# EAGLE design wifi-shield (EAGLE 6.5.0)
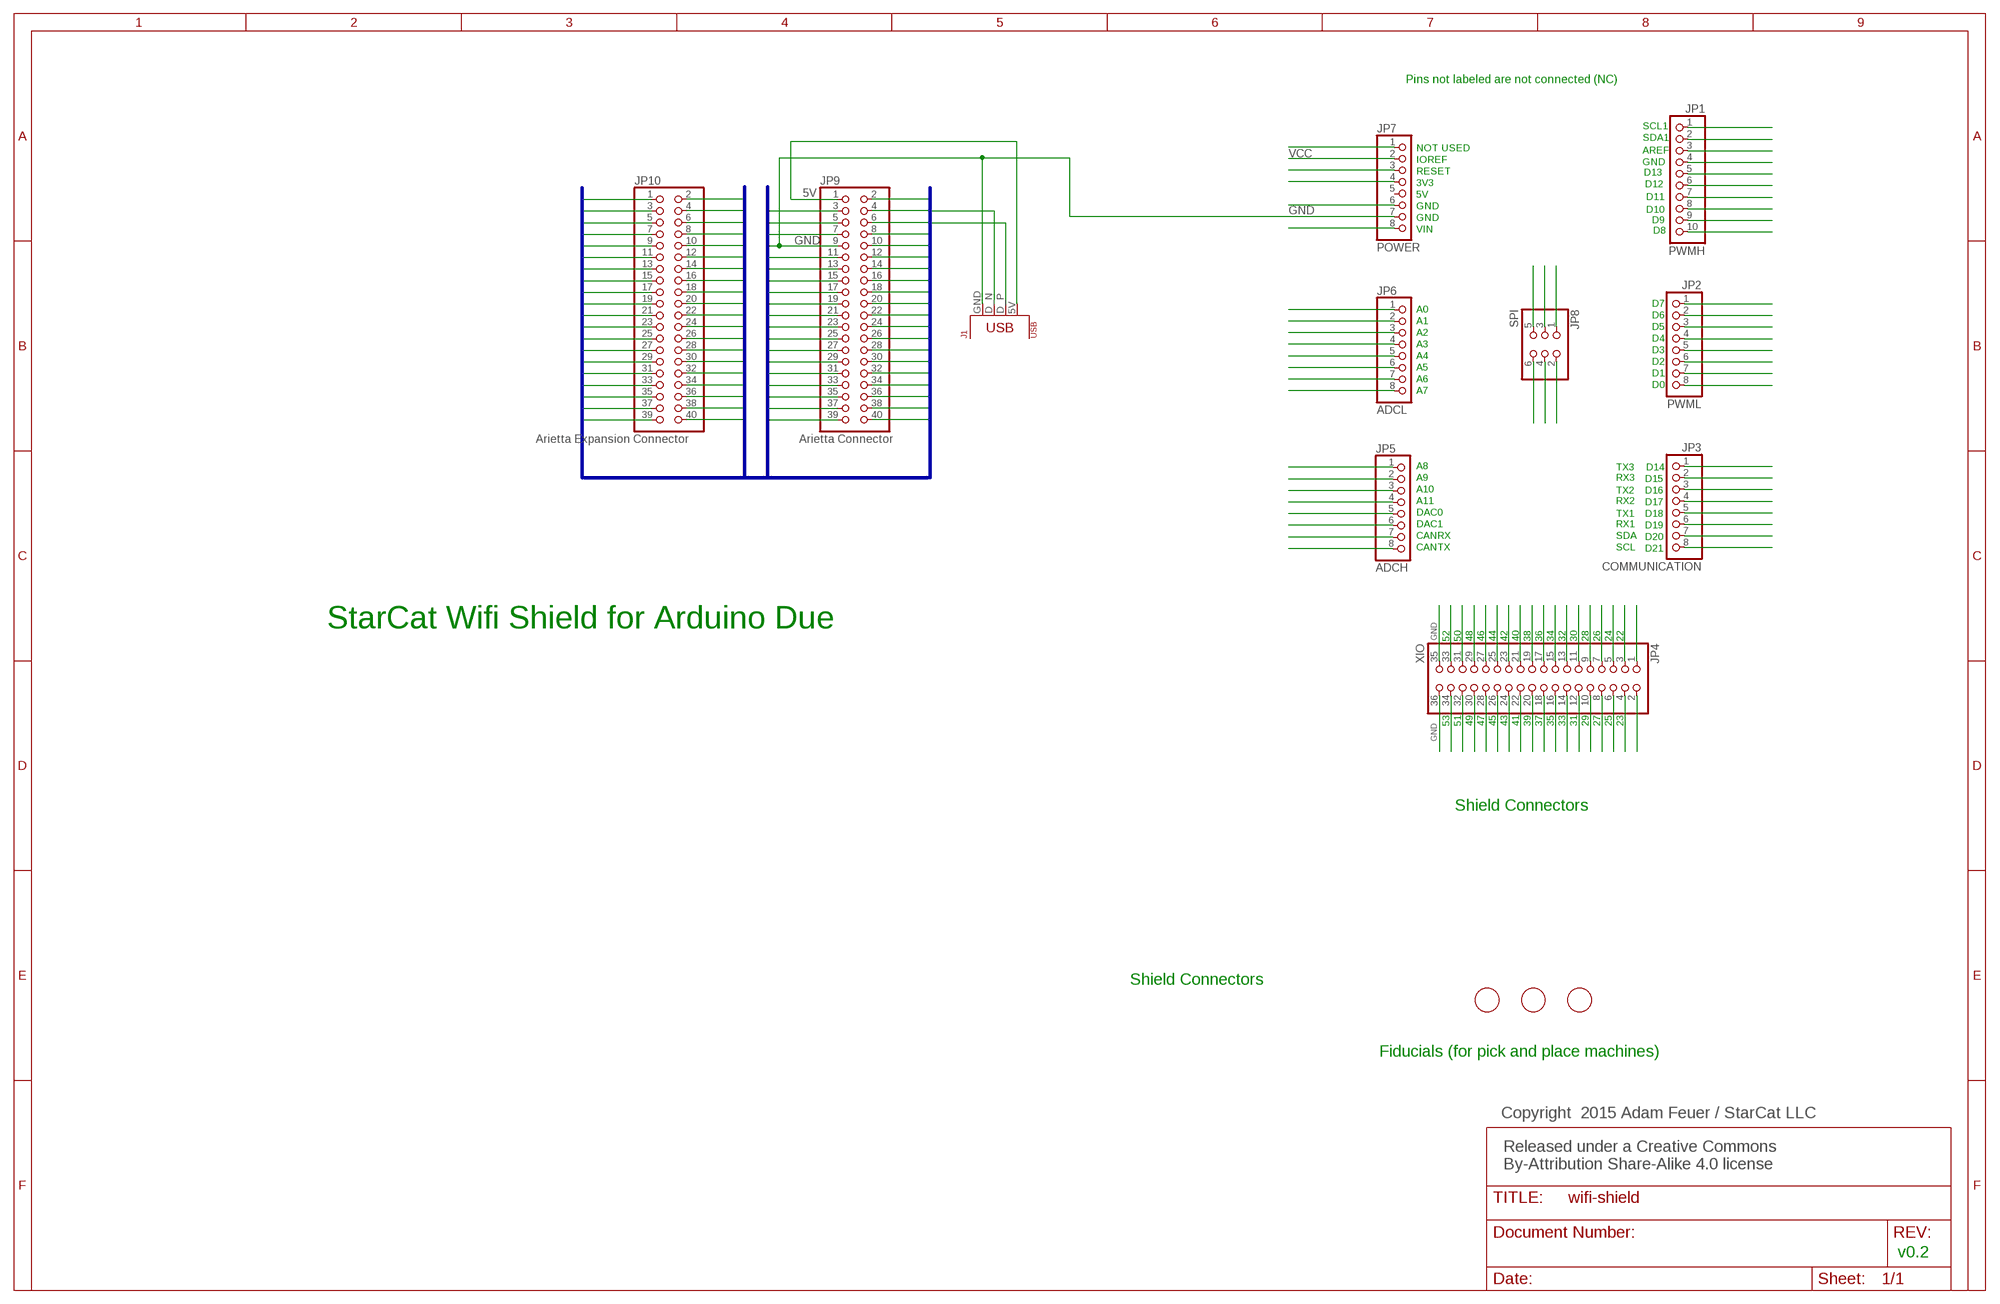
[diagram p0: schematic, sheet 1]

## Parts
J1  USB  USB-A-FEMALEUSB-A-RIGHT-ANGLE  [USB-A-FEMALE-RIGHT-ANGLE]
JP1  PWMH  PINHD-1X10  [1X10]
JP2  PWML  PINHD-1X8  [1X08]
JP3  COMMUNICATION  PINHD-1X8  [1X08]
JP4  XIO  PINHD-2X18  [2X18]
JP5  ADCH  PINHD-1X8  [1X08]
JP6  ADCL  PINHD-1X8  [1X08]
JP7  POWER  PINHD-1X8  [1X08]
JP8  SPI  PINHD-2X3  [2X03]
JP9  Arietta Connector  PINHD-2X20  [2X20]
JP10  Arietta Expansion Connector  PINHD-2X20  [2X20]
U$2  FIDUCIAL  [FIDUCIAL_1MM]
U$5  FIDUCIAL  [FIDUCIAL_1MM]
U$6  FIDUCIAL  [FIDUCIAL_1MM]

## Nets
5V [5V]: J1.5V JP9.1 JP10.1
D2 [DATA]: JP9.2 JP10.2
D3 [DATA]: JP9.3 JP10.3
D5: JP9.5 JP10.5
D7 [DATA]: JP9.7 JP10.7
D8 [DATA]: JP9.8 JP10.8
D10 [DATA]: JP9.10 JP10.10
D11 [DATA]: JP9.11 JP10.11
D12 [DATA]: JP9.12 JP10.12
D13 [DATA]: JP9.13 JP10.13
D14 [DATA]: JP9.14 JP10.14
D15 [DATA]: JP9.15 JP10.15
D16 [DATA]: JP9.16 JP10.16
D17 [DATA]: JP9.17 JP10.17
D18 [DATA]: JP9.18 JP10.18
D19 [DATA]: JP9.19 JP10.19
D20 [DATA]: JP9.20 JP10.20
D21 [DATA]: JP9.21 JP10.21
D22 [DATA]: JP9.22 JP10.22
D23 [DATA]: JP9.23 JP10.23
D24 [DATA]: JP9.24 JP10.24
D25 [DATA]: JP9.25 JP10.25
D26 [DATA]: JP9.26 JP10.26
D27 [DATA]: JP9.27 JP10.27
D28 [DATA]: JP9.28 JP10.28
D29 [DATA]: JP9.29 JP10.29
D30 [DATA]: JP9.30 JP10.30
D31 [DATA]: JP9.31 JP10.31
D32 [DATA]: JP9.32 JP10.32
D33 [DATA]: JP9.33 JP10.33
D34 [DATA]: JP9.34 JP10.34
D35 [DATA]: JP9.35 JP10.35
D36 [DATA]: JP9.36 JP10.36
D37 [DATA]: JP9.37 JP10.37
D38 [DATA]: JP9.38 JP10.38
D39 [DATA]: JP9.39 JP10.39
D40 [DATA]: JP9.40 JP10.40
D43: JP4.24
D45: JP4.26
D_N: J1.D_N JP9.4 JP10.4
D_P: J1.D_P JP9.6 JP10.6
GND [GND]: J1.GND JP4.35 JP4.36 JP7.7 JP9.9 JP10.9
GND1 [GND]: JP8.6
N$1: JP1.9
N$2: JP5.1
N$3: JP7.1
N$4: JP3.7
N$5: JP2.7
N$7: JP1.3
N$8: JP1.4
N$9: JP1.5
N$10: JP1.6
N$11: JP1.7
N$12: JP1.10
N$13: JP2.1
N$14: JP2.2
N$15: JP2.3
N$16: JP2.5
N$17: JP2.6
N$18: JP2.8
N$19: JP3.1
N$22: JP3.2
N$25: JP3.5
N$26: JP3.6
N$32: JP3.8
N$37: JP5.8
N$38: JP4.19
N$39: JP4.20
N$40: JP4.21
N$41: JP4.22
N$42: JP4.23
N$43: JP5.7
N$44: JP5.6
N$44A: JP4.25
N$55: JP5.5
N$56: JP5.4
N$57: JP5.3
N$58: JP5.2
N$65: JP6.4
N$66: JP6.3
N$68: JP6.2
N$69: JP7.8
N$71: JP7.6
N$72: JP7.3
N$73: JP4.34
N$74: JP4.32
N$89: JP4.18
N$91: JP4.16
N$92: JP4.10
N$93: JP4.3
N$94: JP4.9
N$96: JP4.15
N$97: JP4.17
N$109: JP4.31
N$110: JP6.6
N$112: JP6.7
N$115: JP4.1
N$116: JP4.2
N$569: JP6.8
N$571: JP7.4
N$572: JP6.1
N$573: JP6.5
N$574: JP1.1
N$575: JP1.2
N$576: JP1.8
N$577: JP2.4
N$578: JP3.3
N$579: JP3.4
N$580: JP4.5
N$581: JP4.7
N$582: JP4.11
N$583: JP4.13
N$584: JP4.27
N$585: JP4.29
N$586: JP4.33
N$587: JP4.4
N$588: JP4.6
N$589: JP4.8
N$590: JP4.12
N$591: JP4.14
N$592: JP4.30
N$601: JP4.28
RESET: JP8.5
SPI0_MISO: JP8.1
SPI0_MOSI: JP8.4
SPI0_SCK: JP8.3
VCC: JP7.2
VCC_5V: JP8.2
Unconnected: JP7.5

## Buses
D[1..40],D_N,D_P,5V,GND

## Notes on the sheet
- Pins not labeled are not connected (NC)
- SCL1
- SDA1
- NOT USED | AREF
- IOREF | GND
- RESET | D13
- 3V3 | D12
- 5V | D11
- GND
- D10
- GND | D9
- VIN | D8
- D7
- A0
- D6
- A1
- D5
- A2
- D4
- A3
- D3
- A4
- D2
- A5
- D1
- A6
- D0
- A7
- A8 | TX3 | D14
- A9 | RX3 | D15
- A10 | TX2 | D16
- A11 | RX2 | D17
- DAC0 | TX1 | D18
- DAC1 | RX1 | D19
- CANRX | SDA | D20
- CANTX | SCL | D21
- StarCat Wifi Shield for Arduino Due
- 52 | 50 | 48 | 46 | 44 | 42 | 40 | 38 | 36 | 34 | 32 | 30 | 28 | 26 | 24 | 22
- 53 | 51 | 49 | 47 | 45 | 43 | 41 | 39 | 37 | 35 | 33 | 31 | 29 | 27 | 25 | 23
- Shield Connectors
- Shield Connectors
- Fiducials (for pick and place machines)
- Copyright  2015 Adam Feuer / StarCat LLC
- Released under a Creative Commons 
  By-Attribution Share-Alike 4.0 license
- v0.2

## Library data of the parts
J1 = te-conn-usb:USB-A-FEMALE: USB A Female connector - TE Connectivity PN 292303-1
JP1 = SmartPrj:PINHD-1X10: PIN HEADER
JP2 JP3 JP5-JP7 = SmartPrj:PINHD-1X8: PIN HEADER
JP4 = SmartPrj:PINHD-2X18: PIN HEADER
JP8 = SmartPrj:PINHD-2X3: PIN HEADER
JP9 JP10 = adafruit:PINHD-2X20: PIN HEADER
U$2 U$5 U$6 = adafruit:FIDUCIAL: For use by pick and place machines to calibrate the vision/machine, 1mm By microbuilder.eu

## Net classes
0 USB_A: width 0.203 mm, drill 0.203 mm, clearance 0.203 mm
1 5V: width 0.203 mm, drill 0.203 mm, clearance 0.203 mm
2 GND: width 0.203 mm, drill 0.203 mm, clearance 0.203 mm
3 DATA: width 0.203 mm, drill 0.203 mm, clearance 0.203 mm

## Board
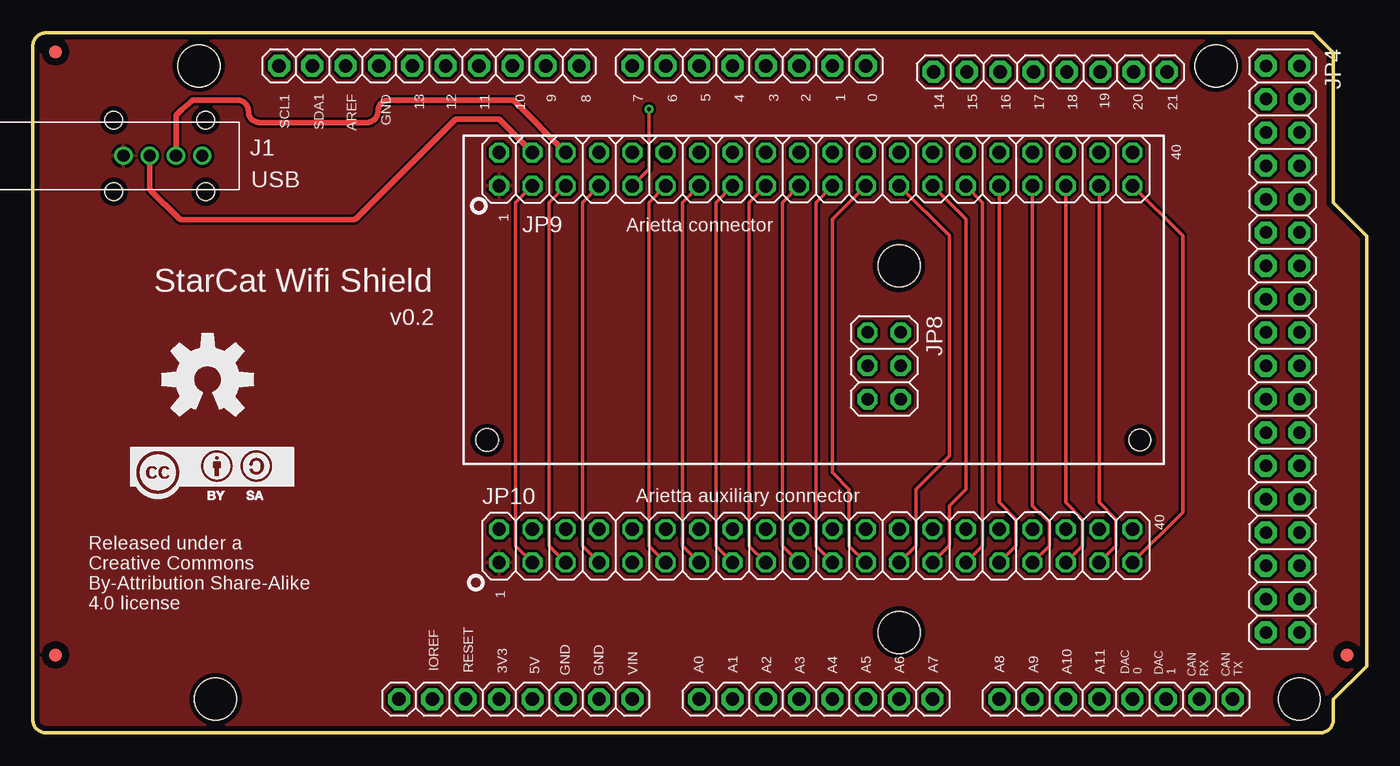
[diagram p1: board, top side]
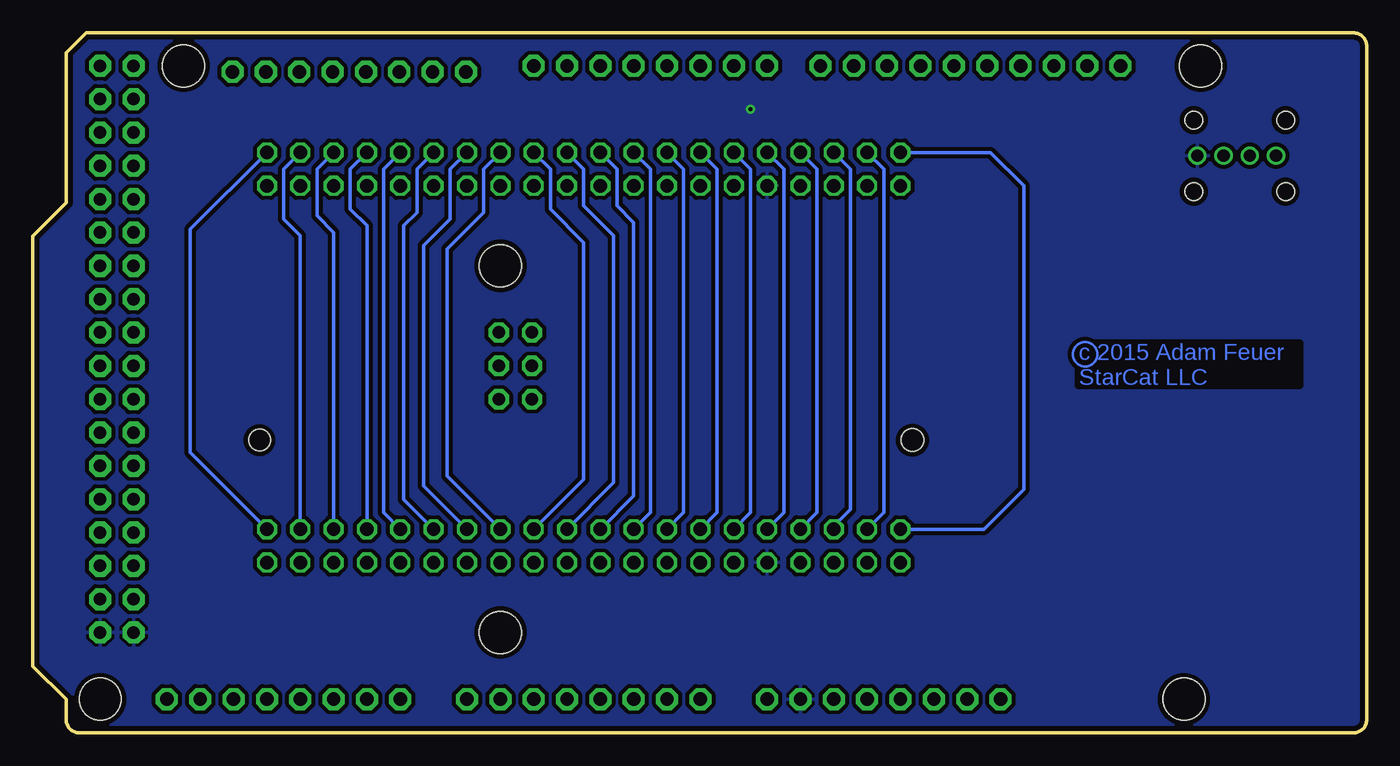
[diagram p2: board, bottom side, seen from below]

Size 101.6 x 53.34 mm. Coordinates in mm from the lower left corner, seen from the top.
Outline: 97.54,53.34 99.06,51.82 99.06,40.39 101.6,37.85 101.6,5.08 99.06,2.54 99.06,1 arc-90 98.06,0 1,0 arc-90 0,1 0,52.34 arc-90 1,53.34 97.54,53.34
Copper layers (1*16): Top 0.0356mm / dielectric 1.5011mm / Bottom 0.0356mm
Design rules "LaenPCBOrder": minimum track width 6mil, minimum drill 13mil, track to track 6mil, track to pad 6mil, pad to pad 6mil, via to via 6mil, smd to smd 6mil, copper to edge 15mil, drill to drill 6mil, minimum pad ring 7mil, minimum via ring 7mil, stop-mask expansion 3mil, vias tented up to drill 0mil, thermal gap 10mil
Holes 3.2 mm at 96.47,2.57 12.65,50.83 90.12,50.83 13.92,2.57 65.99,35.59 65.99,7.65
Holes 1.73 mm at 34.6,22.3
Holes 1.65 mm at 84.34,22.3

### Footprints (pad centres in the part's own frame; a part is rotated, then mirrored left to right if it is on the bottom)
USB-A-FEMALE-RIGHT-ANGLE = drill 0.92: 5V 0,-6; D_N 0,-4; D_P 0,-2; GND 0,0 | hole 1.35: -2.72,0.27; 2.72,-6.73; -2.72,-6.73; 2.72,0.27
1X10 = drill 1.016 pad 1.676 octagon: 1 -11.43,0; 2 -8.89,0; 3 -6.35,0; 4 -3.81,0; 5 -1.27,0; 6 1.27,0; 7 3.81,0; 8 6.35,0; 9 8.89,0; 10 11.43,0
1X08 = drill 1.016 pad 1.676 octagon: 1 -8.89,0; 2 -6.35,0; 3 -3.81,0; 4 -1.27,0; 5 1.27,0; 6 3.81,0; 7 6.35,0; 8 8.89,0
2X18 = drill 0.95 pad 1.676 octagon: 1 -21.59,-1.27; 2 -21.59,1.27; 3 -19.05,-1.27; 4 -19.05,1.27; 5 -16.51,-1.27; 6 -16.51,1.27; 7 -13.97,-1.27; 8 -13.97,1.27; 9 -11.43,-1.27; 10 -11.43,1.27; 11 -8.89,-1.27; 12 -8.89,1.27; 13 -6.35,-1.27; 14 -6.35,1.27; 15 -3.81,-1.27; 16 -3.81,1.27; 17 -1.27,-1.27; 18 -1.27,1.27; 19 1.27,-1.27; 20 1.27,1.27; 21 3.81,-1.27; 22 3.81,1.27; 23 6.35,-1.27; 24 6.35,1.27; 25 8.89,-1.27; 26 8.89,1.27; 27 11.43,-1.27; 28 11.43,1.27; 29 13.97,-1.27; 30 13.97,1.27; 31 16.51,-1.27; 32 16.51,1.27; 33 19.05,-1.27; 34 19.05,1.27; 35 21.59,-1.27; 36 21.59,1.27
2X03 = drill 0.95 pad 1.55 octagon: 1 -2.54,-1.27; 2 -2.54,1.27; 3 0,-1.27; 4 0,1.27; 5 2.54,-1.27; 6 2.54,1.27
2X20 = drill 1.016 octagon: 1 -24.13,-1.27; 2 -24.13,1.27; 3 -21.59,-1.27; 4 -21.59,1.27; 5 -19.05,-1.27; 6 -19.05,1.27; 7 -16.51,-1.27; 8 -16.51,1.27; 9 -13.97,-1.27; 10 -13.97,1.27; 11 -11.43,-1.27; 12 -11.43,1.27; 13 -8.89,-1.27; 14 -8.89,1.27; 15 -6.35,-1.27; 16 -6.35,1.27; 17 -3.81,-1.27; 18 -3.81,1.27; 19 -1.27,-1.27; 20 -1.27,1.27; 21 1.27,-1.27; 22 1.27,1.27; 23 3.81,-1.27; 24 3.81,1.27; 25 6.35,-1.27; 26 6.35,1.27; 27 8.89,-1.27; 28 8.89,1.27; 29 11.43,-1.27; 30 11.43,1.27; 31 13.97,-1.27; 32 13.97,1.27; 33 16.51,-1.27; 34 16.51,1.27; 35 19.05,-1.27; 36 19.05,1.27; 37 21.59,-1.27; 38 21.59,1.27; 39 24.13,-1.27; 40 24.13,1.27
FIDUCIAL_1MM = smd 1 x 1: 1 0,0

### Placement (x,y rotation side)
J1  12.9,43.97 270 top
JP1  30.18,50.83 0 top
JP2  54.56,50.83 0 top
JP3  77.5,50.37 0 top
JP4  95.2,29.24 270 top
JP5  82.5,2.57 0 top
JP6  59.64,2.57 0 top
JP7  36.78,2.57 0 top
JP8  64.85,27.97 270 top
JP9  59.64,42.95 0 top
JP10  59.64,14.25 0 top
U$1  [OSHW-LOGO-L]  13.31,26.92 0 top
U$2  1.73,51.89 0 top
U$5  1.73,5.94 0 top
U$6  100.1,5.94 0 top
U$8  [CC-BY-SA]  7.32,17.48 0 top

### Tracks (layer width: path | path; a pad name or v marks a point on that pad's centre or on a via)
5V
  pour Top (rank 3): 1.19,0 97.54,0 arc90 99.09,0.94 99.06,2.54 101.57,5.16 101.6,37.82 99.06,40.39 99.06,51.79 97.28,53.37 1.12,53.34 arc90 -0.03,51.97 0,1.09 0.03,0.86 arc90
D2
  Bottom 0.254: JP10.2 29.16,15.52 26.11,18.57 26.11,41.68 28.65,44.22 JP9.2
D3
  Top 0.254: JP10.3 36.78,14.25 36.78,40.41 JP9.3
D5
  Top 0.254: JP10.5 39.32,14.25 39.32,40.41 JP9.5
D7
  Top 0.254: JP10.7 41.86,14.25 41.86,40.41 JP9.7
D8
  Bottom 0.254: JP10.8 41.86,16.79 41.86,42.95 JP9.8
D10
  Bottom 0.254: JP10.10 44.4,16.79 44.4,42.95 JP9.10
D11
  Top 0.254: JP10.11 46.94,14.25 46.94,40.41 JP9.11
D12
  Bottom 0.254: JP10.12 46.94,16.79 46.94,42.95 JP9.12
D13
  Top 0.254: JP10.13 49.48,14.25 49.48,40.41 JP9.13
D14
  Bottom 0.254: JP10.14 49.48,16.79 49.48,42.95 JP9.14
D15
  Top 0.254: JP10.15 52.02,14.25 52.02,40.41 JP9.15
D16
  Bottom 0.254: JP10.16 52.02,16.79 52.02,42.95 JP9.16
D17
  Top 0.254: JP10.17 54.56,14.25 54.56,40.41 JP9.17
D18
  Bottom 0.254: JP10.18 54.56,16.79 54.56,42.95 JP9.18
D19
  Top 0.254: JP10.19 57.1,14.25 57.1,40.41 JP9.19
D20
  Bottom 0.254: JP10.20 55.83,18.06 55.83,38.89 57.1,40.16 57.1,42.95 JP9.20
D21
  Top 0.254: JP10.21 59.64,14.25 59.64,40.41 JP9.21
D22
  Bottom 0.254: JP10.22 57.35,19.08 57.35,37.87 59.64,40.16 59.64,42.95 JP9.22
D23
  Top 0.254: JP10.23 62.18,14.25 62.18,18.57 60.91,19.84 60.91,39.14 JP9.23
D24
  Bottom 0.254: JP10.24 59.64,19.33 59.64,37.36 62.18,39.9 62.18,42.95 JP9.24
D25
  Top 0.254: JP10.25 67.26,14.25 67.26,18.57 69.8,21.11 69.8,37.87 JP9.25
D26
  Bottom 0.254: JP10.26 70.05,19.58 70.05,36.86 67.26,39.65 67.26,42.95 JP9.26
D27
  Top 0.254: JP10.27 69.71,14.16 arc45 69.8,14.38 69.8,17.3 71.07,18.57 71.07,39.14 69.8,40.41 69.55,40.67 JP9.27
D28
  Bottom 0.254: JP10.28 71.83,18.82 71.83,37.11 69.8,39.14 69.8,42.95 JP9.28
D29
  Top 0.254: JP10.29 72.25,14.16 arc45 72.34,14.38 72.34,40.41 JP9.29
D30
  Bottom 0.254: JP10.30 73.36,17.81 73.36,38.63 72.34,39.65 72.34,42.95 JP9.30
D31
  Top 0.254: JP10.31 74.88,14.25 74.88,16.28 73.61,17.55 JP9.31
D32
  Bottom 0.254: JP10.32 74.88,16.79 74.88,42.95 JP9.32
D33
  Top 0.254: JP10.33 77.42,14.25 77.42,16.03 76.15,17.3 JP9.33
D34
  Bottom 0.254: JP10.34 76.15,38.63 77.42,39.9 77.42,42.95 JP9.34
D35
  Top 0.254: JP9.35 78.69,17.55 79.96,16.28 79.96,14.25 JP10.35
D36
  Bottom 0.254: JP10.36 78.69,38.13 79.96,39.4 79.96,42.95 JP9.36
D37
  Top 0.254: JP9.37 81.23,17.55 82.5,16.28 82.5,14.25 JP10.37
D38
  Bottom 0.254: JP10.38 81.23,37.87 82.5,39.14 82.5,42.95 JP9.38
D39
  Top 0.254: JP9.39 87.58,37.87 87.58,16.79 JP10.39
D40
  Bottom 0.254: JP10.40 89.61,21.36 89.61,38.38 JP9.40
D_N
  Top 0.406: J1.D_N 8.9,41.55 arc45 9,41.32 11.11,39.21 arc45 11.33,39.12 24.43,39.12 arc45 24.66,39.21 32.11,46.67 arc-45 32.34,46.76 35.51,46.76 JP9.4
  Bottom 0.254: JP10.4 36.78,16.79 36.78,42.95 JP9.4
D_P
  Top 0.406: J1.D_P 10.9,46.94 arc-45 10.98,47.12 11.38,47.52 12.1,48.15 arc-41 12.26,48.21 15.59,48.21 arc-90 16.42,47.37 16.42,47.34 arc90 17.26,46.5 25.45,46.5 arc90 26.29,47.34 26.29,47.37 arc-90 27.13,48.21 36.47,48.21 arc-45 36.69,48.12 JP9.6
  Bottom 0.254: JP10.6 40.59,15.77 39.32,17.04 39.32,42.95 JP9.6
GND  (via drill 0.33)
  Top 0.254: JP9.9 46.85,42.86 arc45 46.94,43.08 v46.94,47.52
  pour Bottom (isolate 0.305): 0.03,52.4 0.03,1.09 arc90 1.04,0.08 98.07,0.08 arc90 99.09,1.09 99.09,2.59 101.57,5.08 101.63,37.92 99.09,40.46 99.09,51.89 97.56,53.42 1.45,53.34 arc90
(copper drawn outside any net)
  shapes: Bottom circle x1

### Text on the board
Bottom: c 2015 Adam Feuer / StarCat LLC
tPlace: SCL1 | SDA1 | AREF | GND | 13 | 12 | 11 | 10 | 9 | 8 | 7 | 6 | 5 | 4 | 3 | 2 | 1 | 0 | 14 | 15 | 16 | 17 | 18 | 19 | 20 | 21 | 40 | 1 | Arietta connector | StarCat Wifi Shield | v0.2 | Arietta auxiliary connector | 40 | 1 | Released under a / Creative Commons / By-Attribution Share-Alike / 4.0 license | IOREF | RESET | 3V3 | A0 | A1 | A2 | A5 | A6 | A7 | A8 | A9 | 5V | GND | GND | VIN | A3 | A4 | A10 | A11 | DAC / 0 | DAC / 1 | CAN / RX | CAN / TX